# EAGLE design SequentialVoltageGenerator (EAGLE 9.6.0)

## Sheet 1 of 2
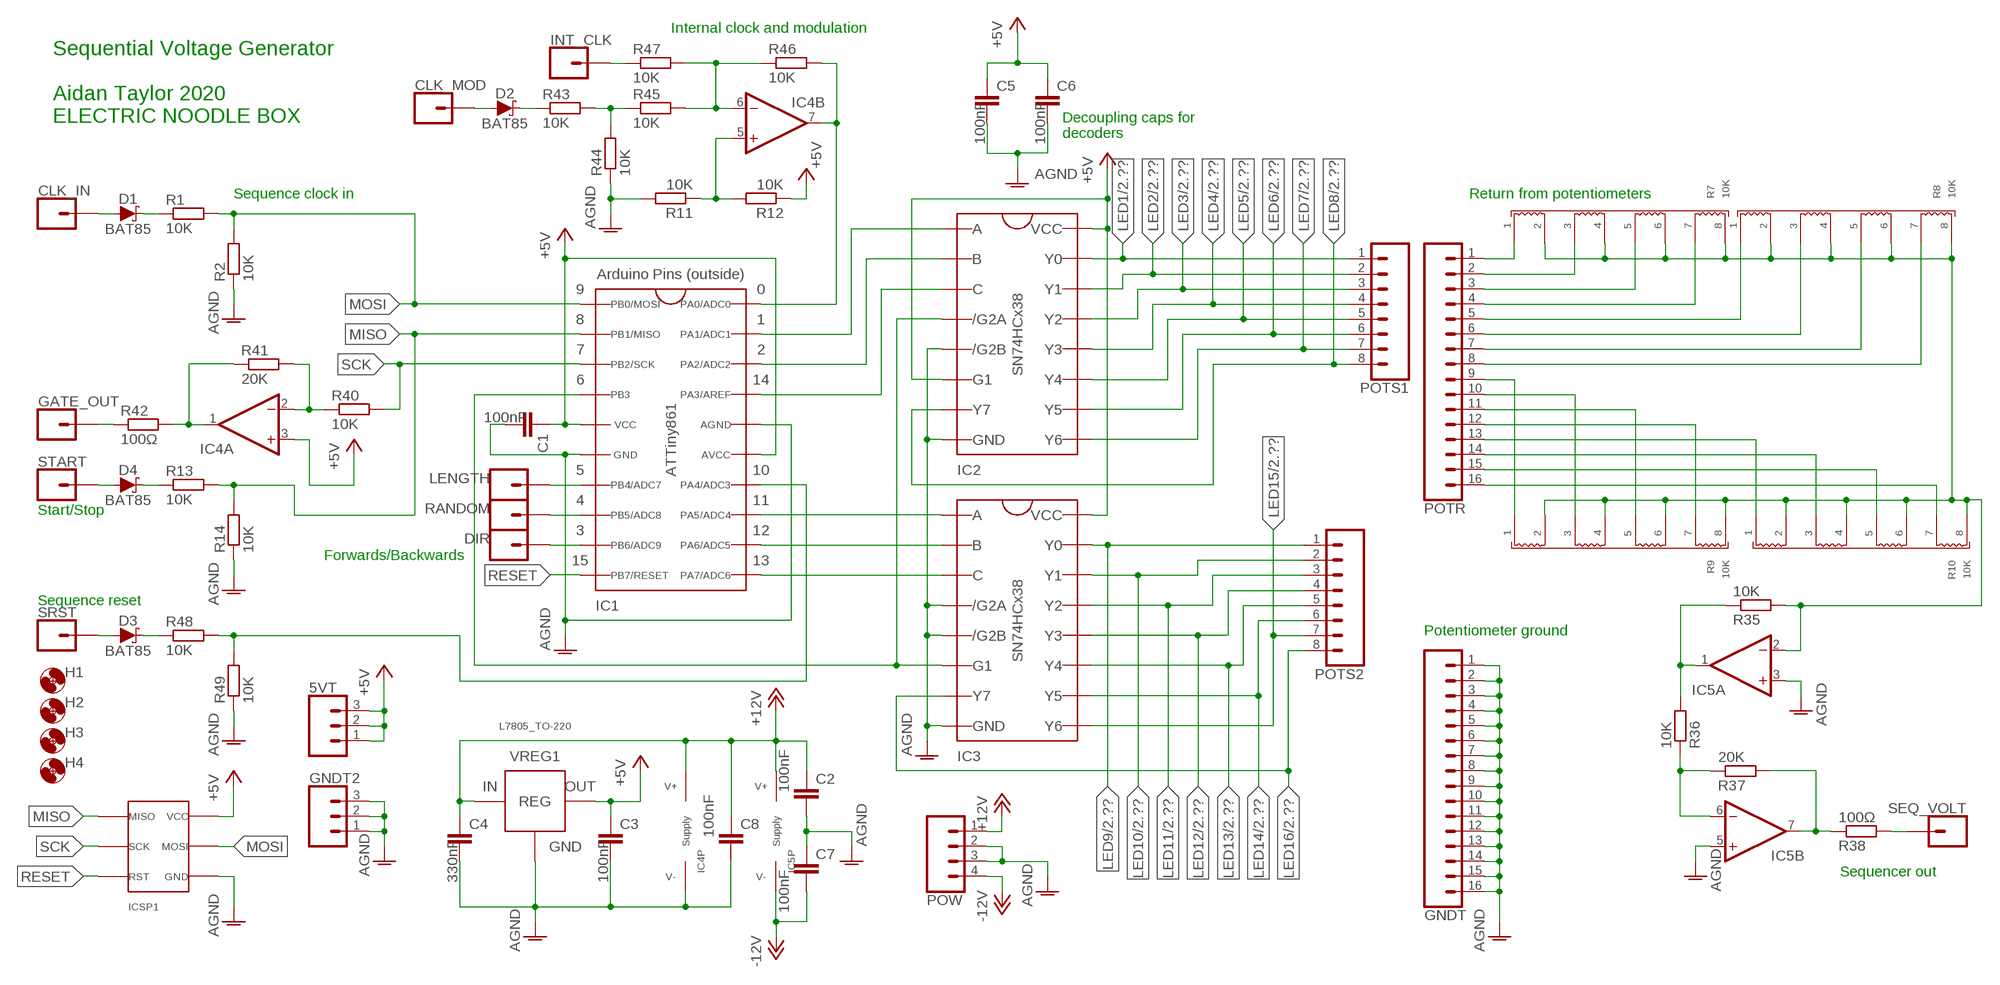
[diagram p0: schematic, sheet 1]

### Parts
5VT  3XWIREPAD  [1X03]
C1  100nF  C-EU050-025X075  [C050-025X075]
C2  100nF  C-EU050-025X075  [C050-025X075]
C3  100nF  C-EU050-025X075  [C050-025X075]
C4  330nF  C-EU050-025X075  [C050-025X075]
C5  100nF  C-EU050-025X075  [C050-025X075]
C6  100nF  C-EU050-025X075  [C050-025X075]
C7  100nF  C-EU050-025X075  [C050-025X075]
C8  100nF  C-EU050-025X075  [C050-025X075]
CLK_IN  1XWIREPAD  [1X01]
CLK_MOD  1XWIREPAD  [1X01]
D1  BAT85  SCHOTTKY_DO35  [DO35-7]
D2  BAT85  SCHOTTKY_DO35  [DO35-7]
D3  BAT85  SCHOTTKY_DO35  [DO35-7]
D4  BAT85  SCHOTTKY_DO35  [DO35-7]
DIR  1XWIREPAD  [1X01]
GATE_OUT  1XWIREPAD  [1X01]
GNDT  16XWIREPAD  [1X16]
GNDT2  3XWIREPAD  [1X03]
H1  MOUNT-HOLE3.2  [3,2]
H2  MOUNT-HOLE3.2  [3,2]
H3  MOUNT-HOLE3.2  [3,2]
H4  MOUNT-HOLE3.2  [3,2]
IC1  ATTINY861_DIP  [DIL20]
IC2  SN74HCX38  [DIL16]
IC3  SN74HCX38  [DIL16]
IC4  LM358_DIP  [DIL08]
IC5  TL0X2_DIP  [DIL08]
ICSP1  ICSP_2.54  [2X3]
INT_CLK  1XWIREPAD  [1X01]
LENGTH  1XWIREPAD  [1X01]
POTR  16XWIREPAD  [1X16]
POTS1  8XWIREPAD  [1X08]
POTS2  8XWIREPAD  [1X08]
POW  4XMOLEX  [MOLEX-1X4]
R1  10K  R-EU_0207/10  [0207/10]
R2  10K  R-EU_0207/10  [0207/10]
R7  10K  4XISO_RESISTOR_NETWORK_2.54  [4_ISO_RES_NET_2.54]
R8  10K  4XISO_RESISTOR_NETWORK_2.54  [4_ISO_RES_NET_2.54]
R9  10K  4XISO_RESISTOR_NETWORK_2.54  [4_ISO_RES_NET_2.54]
R10  10K  4XISO_RESISTOR_NETWORK_2.54  [4_ISO_RES_NET_2.54]
R11  10K  R-EU_0207/10  [0207/10]
R12  10K  R-EU_0207/10  [0207/10]
R13  10K  R-EU_0207/10  [0207/10]
R14  10K  R-EU_0207/10  [0207/10]
R35  10K  R-EU_0207/10  [0207/10]
R36  10K  R-EU_0207/10  [0207/10]
R37  20K  R-EU_0207/10  [0207/10]
R38  100Ω  R-EU_0207/10  [0207/10]
R40  10K  R-EU_0207/10  [0207/10]
R41  20K  R-EU_0207/10  [0207/10]
R42  100Ω  R-EU_0207/10  [0207/10]
R43  10K  R-EU_0207/10  [0207/10]
R44  10K  R-EU_0207/10  [0207/10]
R45  10K  R-EU_0207/10  [0207/10]
R46  10K  R-EU_0207/10  [0207/10]
R47  10K  R-EU_0207/10  [0207/10]
R48  10K  R-EU_0207/10  [0207/10]
R49  10K  R-EU_0207/10  [0207/10]
RANDOM  1XWIREPAD  [1X01]
SEQ_VOLT  1XWIREPAD  [1X01]
SRST  1XWIREPAD  [1X01]
START  1XWIREPAD  [1X01]
VREG1  L7805_TO-220  [TO220H]

### Nets
+5V: 5VT.1 5VT.2 5VT.3 C1.1 C3.1 C5.1 C6.1 IC1.5(VCC) IC1.15(AVCC) IC2.6(6_G1) IC2.16(16_VCC) IC3.16(16_VCC) IC4.3(A:+IN) ICSP1.2(6VCC) R12.1 VREG1.3(VOUT) ; also sheet 2
+12V: C2.1 C4.1 C8.1 IC4.8(P:V+) IC5.8(P:V+) POW.1 VREG1.1(VIN)
-12V: C7.2 IC5.4(P:V-) POW.4
AGND: C1.2 C2.2 C3.2 C4.2 C5.2 C6.2 C7.1 C8.2 GNDT2.1 GNDT2.2 GNDT2.3 GNDT.1 GNDT.2 GNDT.3 GNDT.4 GNDT.5 GNDT.6 GNDT.7 GNDT.8 GNDT.9 GNDT.10 GNDT.11 GNDT.12 GNDT.13 GNDT.14 GNDT.15 GNDT.16 IC1.6(GND) IC1.16(AGND) IC2.5(5_/G2B) IC2.8(8_GND) IC3.4(4_/G2A) IC3.5(5_/G2B) IC3.8(8_GND) IC4.4(P:V-) IC5.3(A:+IN) IC5.5(B:+IN) ICSP1.6(4GND) POW.2 POW.3 R2.1 R11.2 R14.1 R44.1 R49.1 VREG1.2(GND) ; also sheet 2
LED1: IC2.15(15_Y0) POTS1.1 ; also sheet 2
LED2: IC2.14(14_Y1) POTS1.2 ; also sheet 2
LED3: IC2.13(13_Y2) POTS1.3 ; also sheet 2
LED4: IC2.12(12_Y3) POTS1.4 ; also sheet 2
LED5: IC2.11(11_Y4) POTS1.5 ; also sheet 2
LED6: IC2.10(10_Y5) POTS1.6 ; also sheet 2
LED7: IC2.9(9_Y6) POTS1.7 ; also sheet 2
LED8: IC2.7(7_Y7) POTS1.8 ; also sheet 2
LED9: IC3.15(15_Y0) POTS2.1 ; also sheet 2
LED10: IC3.14(14_Y1) POTS2.2 ; also sheet 2
LED11: IC3.13(13_Y2) POTS2.3 ; also sheet 2
LED12: IC3.12(12_Y3) POTS2.4 ; also sheet 2
LED13: IC3.11(11_Y4) POTS2.5 ; also sheet 2
LED14: IC3.10(10_Y5) POTS2.6 ; also sheet 2
LED15: IC3.9(9_Y6) POTS2.7 ; also sheet 2
LED16: IC3.7(7_Y7) POTS2.8 ; also sheet 2
MISO: IC1.2(2_PB1) ICSP1.1(1MISO) R13.2 R14.2
MOSI: IC1.1(1_PB0) ICSP1.4(5MOSI) R1.2 R2.2
N$1: IC1.4(4_PB3) IC2.4(4_/G2A) IC3.6(6_G1)
N$2: IC1.17(17_PA3) IC2.3(3_C)
N$3: IC1.18(18_PA2) IC2.2(2_B)
N$4: IC1.19(19_PA1) IC2.1(1_A)
N$5: D4.A START.1
N$6: IC1.12(12_PA6) IC3.2(2_B)
N$7: IC1.11(11_PA7) IC3.3(3_C)
N$8: CLK_IN.1 D1.A
N$9: D1.C R1.1
N$42: POTR.1 R7.P$1
N$43: POTR.2 R7.P$3
N$44: POTR.3 R7.P$5
N$45: POTR.4 R7.P$7
N$46: POTR.5 R8.P$1
N$47: POTR.6 R8.P$3
N$48: POTR.7 R8.P$5
N$49: POTR.8 R8.P$7
N$50: POTR.9 R9.P$1
N$51: POTR.10 R9.P$3
N$52: POTR.11 R9.P$5
N$53: POTR.12 R9.P$7
N$54: POTR.13 R10.P$1
N$55: POTR.14 R10.P$3
N$56: POTR.15 R10.P$5
N$57: POTR.16 R10.P$7
N$58: IC5.2(A:-IN) R7.P$2 R7.P$4 R7.P$6 R7.P$8 R8.P$2 R8.P$4 R8.P$6 R8.P$8 R9.P$2 R9.P$4 R9.P$6 R9.P$8 R10.P$2 R10.P$4 R10.P$6 R10.P$8 R35.2
N$59: IC5.1(A:OUT) R35.1 R36.2
N$60: IC5.6(B:-IN) R36.1 R37.1
N$61: R38.2 SEQ_VOLT.1
N$62: IC5.7(B:OUT) R37.2 R38.1
N$63: IC4.2(A:-IN) R40.1 R41.2
N$64: GATE_OUT.1 R42.1
N$65: IC4.1(A:OUT) R41.1 R42.2
N$66: D2.C R43.1
N$67: R43.2 R44.2 R45.1
N$68: IC4.6(B:-IN) R45.2 R46.1 R47.2
N$69: IC1.20(20_PA0) IC4.7(B:OUT) R46.2
N$70: INT_CLK.1 R47.1
N$71: CLK_MOD.1 D2.A
N$72: IC1.7(7_PB4) LENGTH.1
N$73: IC1.8(8_PB5) RANDOM.1
N$74: DIR.1 IC1.9(9_PB6)
N$75: D3.A SRST.1
N$76: D3.C R48.1
N$77: IC1.14(14_PA4) R48.2 R49.2
N$78: IC4.5(B:+IN) R11.1 R12.2
N$79: IC1.13(13_PA5) IC3.1(1_A)
N$80: D4.C R13.1
RESET: IC1.10(10_PB7) ICSP1.5(3RST)
SCK: IC1.3(3_PB2) ICSP1.3(2SCK) R40.2

### Notes on the sheet
- Internal clock and modulation
- Sequential Voltage Generator
  
  Aidan Taylor 2020
  ELECTRIC NOODLE BOX
- Decoupling caps for
  decoders
- Sequence clock in | Return from potentiometers
- Start/Stop
- Forwards/Backwards
- Sequence reset
- Potentiometer ground
- Sequencer out

## Sheet 2 of 2
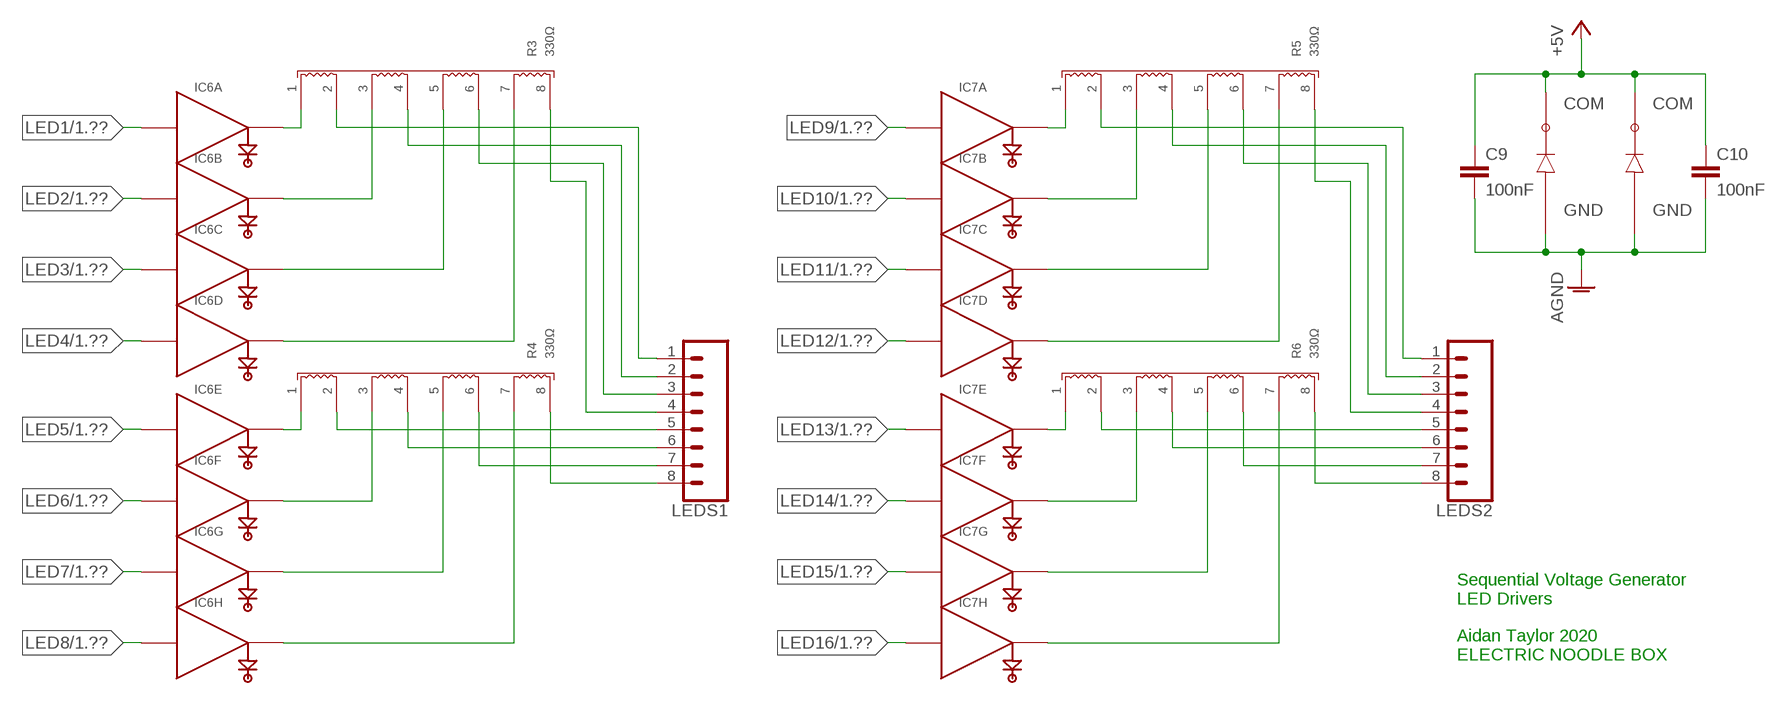
[diagram p1: schematic, sheet 2]

### Parts
C9  100nF  C-EU050-025X075  [C050-025X075]
C10  100nF  C-EU050-025X075  [C050-025X075]
IC6  ULN2801_DIP  [DIL18]
IC7  ULN2801_DIP  [DIL18]
LEDS1  8XWIREPAD  [1X08]
LEDS2  8XWIREPAD  [1X08]
R3  330Ω  4XISO_RESISTOR_NETWORK_2.54  [4_ISO_RES_NET_2.54]
R4  330Ω  4XISO_RESISTOR_NETWORK_2.54  [4_ISO_RES_NET_2.54]
R5  330Ω  4XISO_RESISTOR_NETWORK_2.54  [4_ISO_RES_NET_2.54]
R6  330Ω  4XISO_RESISTOR_NETWORK_2.54  [4_ISO_RES_NET_2.54]

### Nets
+5V: C9.1 C10.1 IC6.10(COM) IC7.10(COM) ; also sheet 1
AGND: C9.2 C10.2 IC6.9(GND) IC7.9(GND) ; also sheet 1
LED1: IC6.1(A:IN) ; also sheet 1
LED2: IC6.2(B:IN) ; also sheet 1
LED3: IC6.3(C:IN) ; also sheet 1
LED4: IC6.4(D:IN) ; also sheet 1
LED5: IC6.5(E:IN) ; also sheet 1
LED6: IC6.6(F:IN) ; also sheet 1
LED7: IC6.7(G:IN) ; also sheet 1
LED8: IC6.8(H:IN) ; also sheet 1
LED9: IC7.1(A:IN) ; also sheet 1
LED10: IC7.2(B:IN) ; also sheet 1
LED11: IC7.3(C:IN) ; also sheet 1
LED12: IC7.4(D:IN) ; also sheet 1
LED13: IC7.5(E:IN) ; also sheet 1
LED14: IC7.6(F:IN) ; also sheet 1
LED15: IC7.7(G:IN) ; also sheet 1
LED16: IC7.8(H:IN) ; also sheet 1
N$10: IC6.18 R3.P$1
N$11: LEDS1.1 R3.P$2
N$12: IC6.17 R3.P$3
N$13: LEDS1.2 R3.P$4
N$14: IC6.16 R3.P$5
N$15: LEDS1.3 R3.P$6
N$16: IC6.15 R3.P$7
N$17: LEDS1.4 R3.P$8
N$18: IC6.14 R4.P$1
N$19: LEDS1.5 R4.P$2
N$20: IC6.13 R4.P$3
N$21: LEDS1.6 R4.P$4
N$22: IC6.12 R4.P$5
N$23: LEDS1.7 R4.P$6
N$24: IC6.11 R4.P$7
N$25: LEDS1.8 R4.P$8
N$26: IC7.18 R5.P$1
N$27: LEDS2.1 R5.P$2
N$28: IC7.17 R5.P$3
N$29: LEDS2.2 R5.P$4
N$30: IC7.16 R5.P$5
N$31: LEDS2.3 R5.P$6
N$32: IC7.15 R5.P$7
N$33: LEDS2.4 R5.P$8
N$34: IC7.14 R6.P$1
N$35: LEDS2.5 R6.P$2
N$36: IC7.13 R6.P$3
N$37: LEDS2.6 R6.P$4
N$38: IC7.12 R6.P$5
N$39: LEDS2.7 R6.P$6
N$40: IC7.11 R6.P$7
N$41: LEDS2.8 R6.P$8

### Notes on the sheet
- Sequential Voltage Generator
  LED Drivers
  
  Aidan Taylor 2020
  ELECTRIC NOODLE BOX

## Library data of the parts
5VT GNDT2 = ElectricNoodleBox:3XWIREPAD
C1-C10 = rcl:C-EU: CAPACITOR, European symbol; SPICEPREFIX: C
CLK_IN CLK_MOD DIR GATE_OUT INT_CLK LENGTH RANDOM SEQ_VOLT SRST START = ElectricNoodleBox:1XWIREPAD
D1-D4 = ElectricNoodleBox:SCHOTTKY_DO35
GNDT POTR = ElectricNoodleBox:16XWIREPAD
H1-H4 = holes:MOUNT-HOLE: MOUNTING HOLE with drill center marker
IC1 = ElectricNoodleBox:ATTINY861_DIP
IC2 IC3 = ElectricNoodleBox:SN74HCX38
IC4 = ElectricNoodleBox:LM358_DIP
IC5 = ElectricNoodleBox:TL0X2_DIP
IC6 IC7 = ElectricNoodleBox:ULN2801_DIP
ICSP1 = ElectricNoodleBox:ICSP_2.54
LEDS1 LEDS2 POTS1 POTS2 = ElectricNoodleBox:8XWIREPAD
POW = ElectricNoodleBox:4XMOLEX
R1 R2 R11-R14 R35-R38 R40-R49 = rcl:R-EU_: RESISTOR, European symbol; SPICEPREFIX: R
R3-R10 = ElectricNoodleBox:4XISO_RESISTOR_NETWORK_2.54
VREG1 = ElectricNoodleBox:L7805_TO-220

## Board
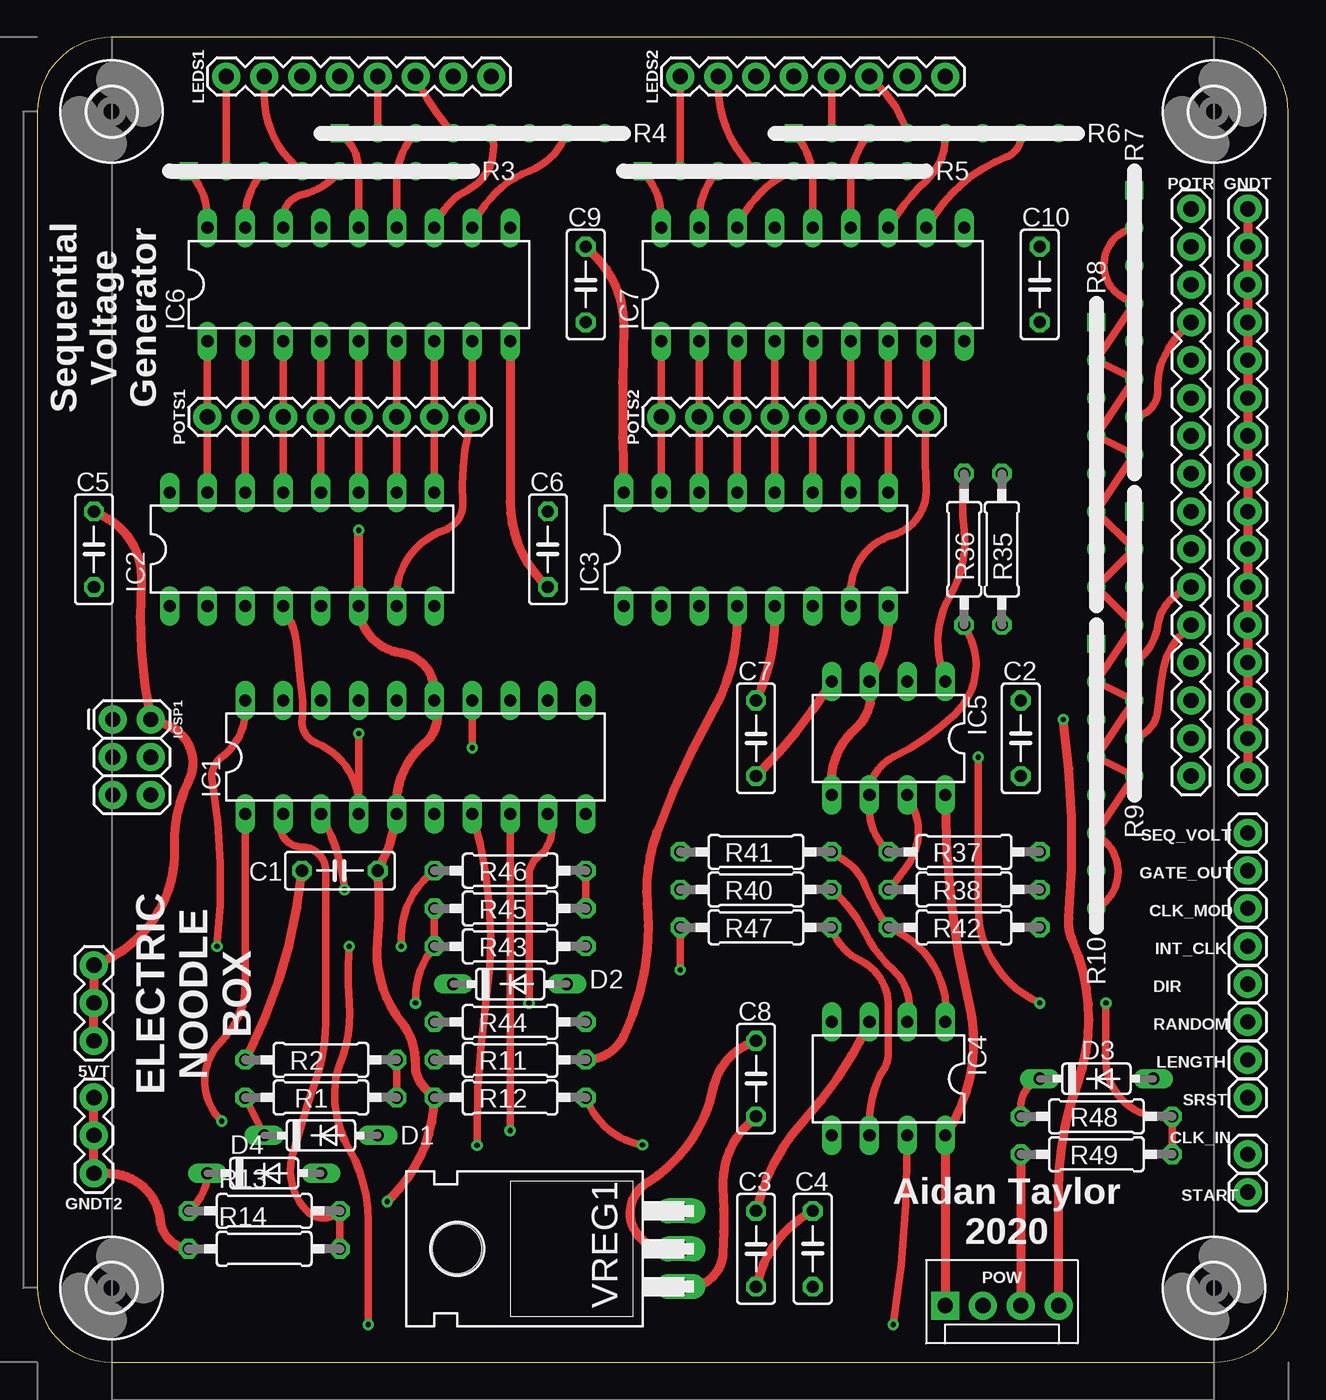
[diagram p2: board, top side]
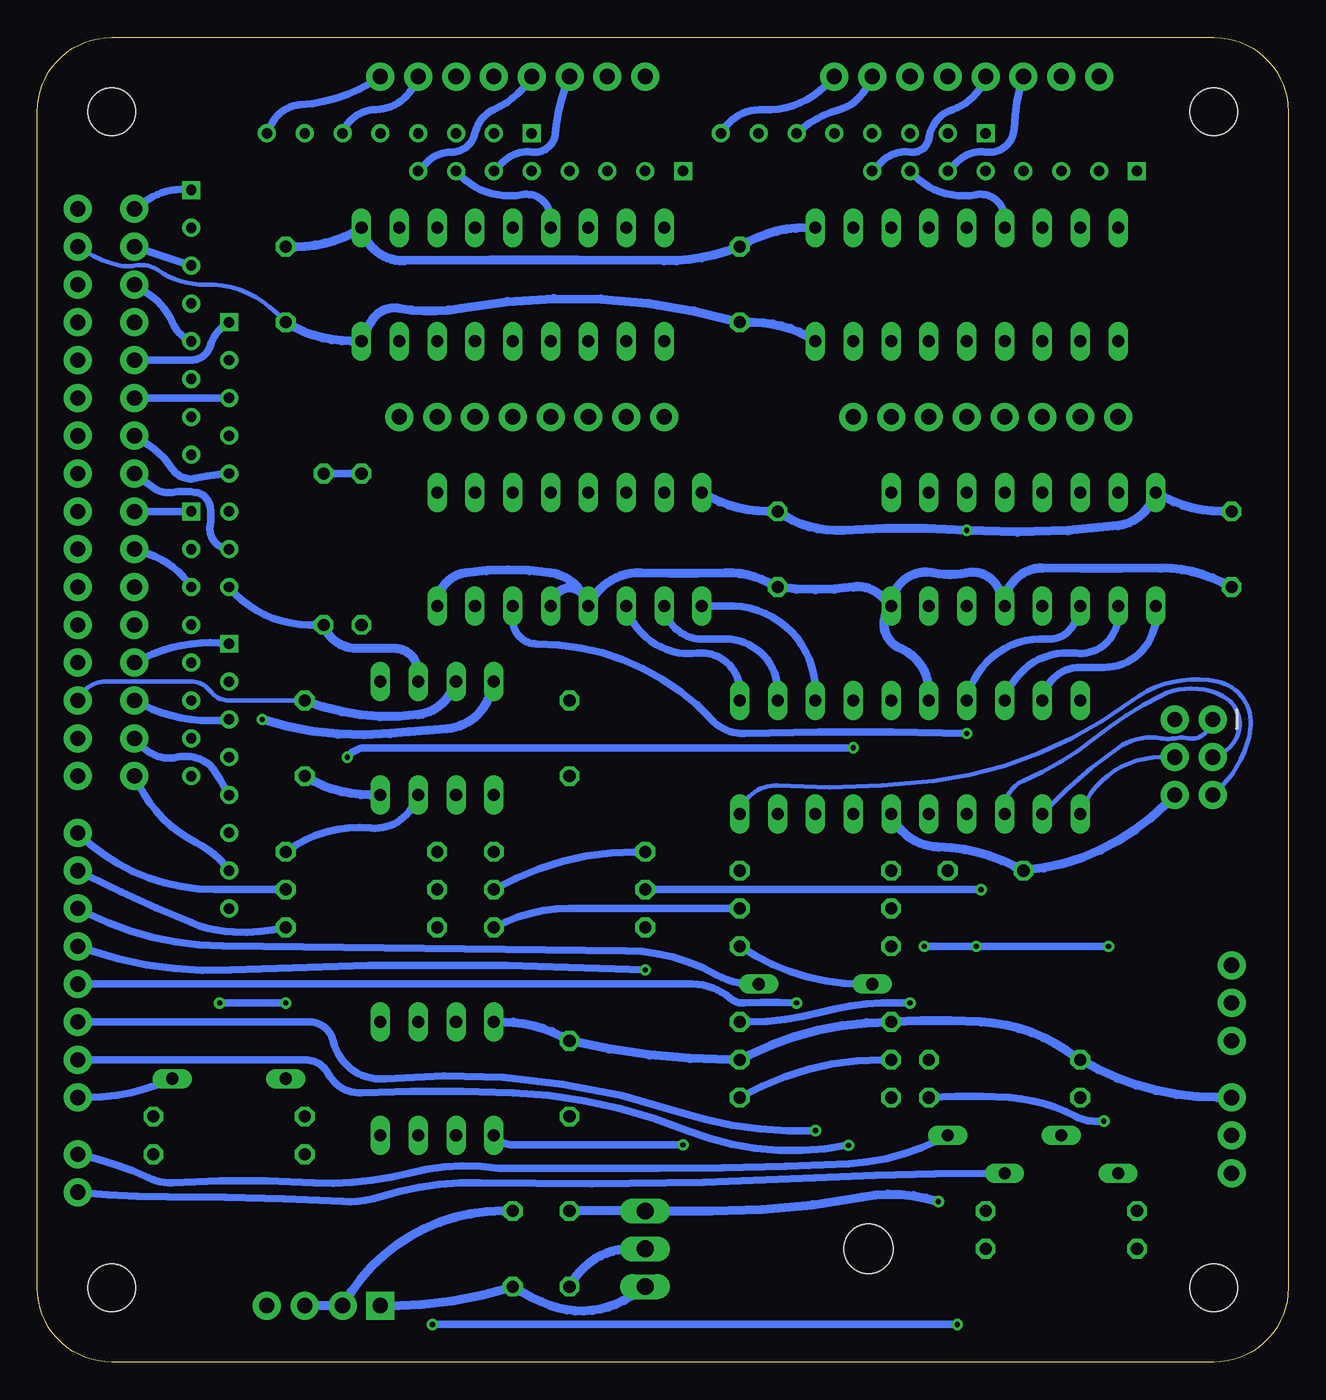
[diagram p3: board, bottom side, seen from below]

Size 84 x 89 mm. Coordinates in mm from the lower left corner, seen from the top.
Outline: 0,84 0,5 arc90 5,0 79,0 arc90 84,5 84,84 arc90 79,89 5,89 arc90 0,84
Copper layers (1*16): Top 0.035mm / dielectric 1.5mm / Bottom 0.035mm
Design rules "default": minimum track width 6mil, minimum drill 0.35mm, track to track 6mil, track to pad 6mil, pad to pad 6mil, via to via 6mil, smd to smd 6mil, copper to edge 40mil, drill to drill 6mil, minimum pad ring 10mil, minimum via ring 8mil, stop-mask expansion 4mil, vias tented up to drill 0mil, thermal gap 10mil

### Footprints (pad centres in the part's own frame; a part is rotated, then mirrored left to right if it is on the bottom)
1X03 = drill 1.016 pad 1.88: 1 0,0; 2 2.54,0; 3 5.08,0
C050-025X075 = drill 0.813 octagon: 1 -2.54,0; 2 2.54,0
1X01 = drill 1.016 pad 1.88: 1 0,0
DO35-7 = drill 0.813 long: A 3.81,0; C -3.81,0
1X16 = drill 1.016 pad 1.88: 1 0,0; 2 2.54,0; 3 5.08,0; 4 7.62,0; 5 10.16,0; 6 12.7,0; 7 15.24,0; 8 17.78,0; 9 20.32,0; 10 22.86,0; 11 25.4,0; 12 27.94,0; 13 30.48,0; 14 33.02,0; 15 35.56,0; 16 38.1,0
3,2 = hole 3.2: 0,0
DIL20 = drill 0.813 long: 1 -11.43,-3.81; 2 -8.89,-3.81; 3 -6.35,-3.81; 4 -3.81,-3.81; 5 -1.27,-3.81; 6 1.27,-3.81; 7 3.81,-3.81; 8 6.35,-3.81; 9 8.89,-3.81; 10 11.43,-3.81; 11 11.43,3.81; 12 8.89,3.81; 13 6.35,3.81; 14 3.81,3.81; 15 1.27,3.81; 16 -1.27,3.81; 17 -3.81,3.81; 18 -6.35,3.81; 19 -8.89,3.81; 20 -11.43,3.81
DIL16 = drill 0.813 long: 1 -8.89,-3.81; 2 -6.35,-3.81; 3 -3.81,-3.81; 4 -1.27,-3.81; 5 1.27,-3.81; 6 3.81,-3.81; 7 6.35,-3.81; 8 8.89,-3.81; 9 8.89,3.81; 10 6.35,3.81; 11 3.81,3.81; 12 1.27,3.81; 13 -1.27,3.81; 14 -3.81,3.81; 15 -6.35,3.81; 16 -8.89,3.81
DIL08 = drill 0.813 long: 1 -3.81,-3.81; 2 -1.27,-3.81; 3 1.27,-3.81; 4 3.81,-3.81; 5 3.81,3.81; 6 1.27,3.81; 7 -1.27,3.81; 8 -3.81,3.81
DIL18 = drill 0.813 long: 1 -10.16,-3.81; 2 -7.62,-3.81; 3 -5.08,-3.81; 4 -2.54,-3.81; 5 0,-3.81; 6 2.54,-3.81; 7 5.08,-3.81; 8 7.62,-3.81; 9 10.16,-3.81; 10 10.16,3.81; 11 7.62,3.81; 12 5.08,3.81; 13 2.54,3.81; 14 0,3.81; 15 -2.54,3.81; 16 -5.08,3.81; 17 -7.62,3.81; 18 -10.16,3.81
2X3 = drill 1.016 pad 1.88: 1 0,0; 2 0,2.54; 3 2.54,0; 4 2.54,2.54; 5 5.08,0; 6 5.08,2.54
1X08 = drill 1.016 pad 1.88: 1 0,0; 2 2.54,0; 3 5.08,0; 4 7.62,0; 5 10.16,0; 6 12.7,0; 7 15.24,0; 8 17.78,0
MOLEX-1X4 = drill 1.016 pad 1.88 square: 1 0,0 | drill 1.016 pad 1.88: 2 2.54,0; 3 5.08,0; 4 7.62,0
0207/10 = drill 0.813 octagon: 1 -5.08,0; 2 5.08,0
4_ISO_RES_NET_2.54 = drill 0.7 square: P$1 -8.89,0 | drill 0.7: P$2 -6.35,0; P$3 -3.81,0; P$4 -1.27,0; P$5 1.27,0; P$6 3.81,0; P$7 6.35,0; P$8 8.89,0
TO220H = drill 1.118 long: 1 -2.54,-10.16; 2 0,-10.16; 3 2.54,-10.16 | hole 3.302: 0,4.826

### Placement (x,y rotation side)
5VT  3.81,21.59 90 top
C1  20.32,33.02 180 top
C2  66.04,41.91 90 top
C3  48.26,7.62 270 top
C4  52.07,7.62 90 top
C5  3.81,54.61 270 top
C6  34.29,54.61 270 top
C7  48.26,41.91 270 top
C8  48.26,19.05 90 top
C9  36.83,72.39 270 top
C10  67.31,72.39 270 top
CLK_IN  81.28,13.97 0 top
CLK_MOD  81.28,30.48 0 top
D1  19.05,15.24 0 top
D2  31.75,25.4 0 top
D3  71.12,19.05 0 top
D4  15.24,12.7 0 top
DIR  81.28,25.4 0 top
GATE_OUT  81.28,33.02 0 top
GNDT  81.28,77.47 270 top
GNDT2  3.81,12.7 90 top
H1  79,5 0 top
H2  5,5 0 top
H3  79,84 0 top
H4  5,84 0 top
IC1  25.4,40.64 0 top
IC2  17.78,54.61 0 top
IC3  48.26,54.61 0 top
IC4  57.15,19.05 180 top
IC5  57.15,41.91 180 top
IC6  21.59,72.39 0 top
IC7  52.07,72.39 0 top
ICSP1  5.08,43.18 270 top
INT_CLK  81.28,27.94 0 top
LEDS1  12.7,86.36 0 top
LEDS2  43.18,86.36 0 top
LENGTH  81.28,20.32 0 top
POTR  77.47,77.47 270 top
POTS1  11.43,63.5 0 top
POTS2  41.91,63.5 0 top
POW  60.96,3.81 0 top
R1  19.05,17.78 0 top
R2  19.05,20.32 0 top
R3  19.05,80.01 0 top
R4  29.21,82.55 0 top
R5  49.53,80.01 0 top
R6  59.69,82.55 0 top
R7  73.66,69.85 270 top
R8  71.12,60.96 270 top
R9  73.66,48.26 270 top
R10  71.12,39.37 270 top
R11  31.75,20.32 0 top
R12  31.75,17.78 0 top
R13  15.24,10.16 0 top
R14  15.24,7.62 0 top
R35  64.77,54.61 270 top
R36  62.23,54.61 90 top
R37  62.23,34.29 0 top
R38  62.23,31.75 0 top
R40  48.26,31.75 180 top
R41  48.26,34.29 180 top
R42  62.23,29.21 180 top
R43  31.75,27.94 180 top
R44  31.75,22.86 0 top
R45  31.75,30.48 0 top
R46  31.75,33.02 180 top
R47  48.26,29.21 0 top
R48  71.12,16.51 0 top
R49  71.12,13.97 0 top
RANDOM  81.28,22.86 0 top
SEQ_VOLT  81.28,35.56 0 top
SRST  81.28,17.78 0 top
START  81.28,11.43 0 top
VREG1  33.02,7.62 90 top

### Tracks (layer width: path | path; a pad name or v marks a point on that pad's centre or on a via)
+5V  (via drill 0.35)
  Top 0.61: C9.1 37.47,74.3 arc-46 39.37,69.53 arc3 IC3.16 | C5.1 4.45,56.83 arc-67 6.99,52.39 arc16 ICSP1.2 8.57,42.86 arc-98 10.16,39.05 arc28 9.21,34.61 arc-73 5VT.3 5VT.2 5VT.1 | v21.59,55.88 IC2.6 arc81 24.45,47.62 arc-82 26.67,45.09 IC1.15 arc-74 26.04,41.59 arc50 24.13,37.47 IC1.5 arc-20 23.18,33.66 C1.1 arc-11 22.86,28.26 arc44 24.45,22.86 arc-40 25.4,20 arc46 26.04,18.41 R12.1 arc-44 23.81,11.11 v23.5,10.79 | IC4.3 55.56,22.23 arc-16 51.44,16.19 arc29 C3.1
  Bottom 0.61: C5.1 4.45,57.15 arc32 IC2.16 9.21,57.78 arc56 11.43,56.2 arc12 v21.59,55.88 arc-8 29.84,55.88 arc40 C6.1 34.92,57.15 arc32 IC3.16 | IC6.10 32.38,76.2 arc-32 C9.1 37.78,74.61 arc19 41.91,73.98 arc-2 59.37,73.98 arc78 IC7.10 arc32 66.67,74.93 C10.1 | C3.1 VREG1.3 38.73,10.16 arc-11 28.57,11.11 arc29 v23.5,10.79
+12V
  Top 0.61: IC5.8 60.96,37.47 arc14 62.55,24.13 arc-47 IC4.8 POW.1 | C8.1 47.62,15.88 arc48 46.04,11.75 arc-6 46.04,7.3 arc-98 VREG1.1
  Bottom 0.61: IC5.8 61.59,38.1 arc32 C2.1 | VREG1.1 44.13,4.45 arc54 49.53,3.81 arc13 C4.1 arc17 60.33,3.81 POW.1
-12V  (via drill 0.35)
  Top 0.61: C7.2 48.58,39.69 arc10 52.07,43.81 arc4 IC5.4 | POW.4 68.58,11.43 arc-20 69.85,18.73 arc43 69.53,28.26 arc-28 69.27,29.84 arc12 v68.9,43.18
  Bottom 0.61: IC5.4 53.66,44.77 arc67 56.52,42.55 arc-1 60.33,42.23 arc23 v68.9,43.18
AGND
  Top 0.61: C6.2 arc-48 31.75,57.78 IC6.9 | GNDT.1 GNDT.2 GNDT.3 GNDT.4 GNDT.5 GNDT.6 GNDT.7 GNDT.8 GNDT.9 GNDT.10 GNDT.11 GNDT.12 GNDT.13 GNDT.14 GNDT.15 GNDT.16 | IC3.5 49.53,50.16 arc-25 C7.1 | IC3.8 57.15,50.16 arc-32 IC5.3 arc-64 54.93,42.55 arc49 53.34,39.05 IC5.5 | C3.2 48.58,6.03 arc-44 C4.2 | R49.1 POW.3 | R2.1 14.29,20.95 arc21 C1.2 | GNDT2.3 GNDT2.2 GNDT2.1 4.76,12.7 arc-85 8.26,9.53 arc79 R14.1 | VREG1.2 42.23,7.62 arc-148 40.96,12.06 arc46 45.4,18.41 arc-60 C8.2 | IC3.4 46.99,49.85 arc-29 45.4,43.81 arc9 41.59,35.56 arc25 40.96,30.8 arc-30 39.37,21.91 arc-66 R11.2
  Bottom 0.305: C2.2 71.12,44.45 arc53 72.39,45.09 arc-53 73.66,45.72 79.38,45.72 arc-67 GNDT.14 | C10.2 67.94,70.48 arc-46 72.71,72.39 arc36 75.88,73.34 arc-47 77.47,73.66 arc24 78.42,73.66 arc24 GNDT.2
  Bottom 0.61: C5.2 4.45,52.39 arc-27 8.57,53.34 arc1 16.51,53.34 arc-91 IC2.5 19.37,51.75 arc-84 21.59,53.02 arc24 23.81,53.02 arc-100 IC2.8 | C10.2 arc-32 62.87,68.58 IC7.9 61.59,69.85 arc74 59.69,70.8 arc-21 55.56,70.8 arc26 C9.2 35.88,69.85 arc34 IC6.9 | IC2.8 27.3,51.44 arc-53 29.21,52.07 arc16 C6.2 34.92,52.39 arc-28 37.78,53.02 arc3 43.5,53.02 arc-68 IC3.4 47.31,51.44 | 47.31,51.44 arc-56 49.53,53.02 arc-15 55.24,53.02 arc-84 IC3.8 | IC3.5 49.21,51.44 arc127 47.31,51.44 | IC1.16 24.13,45.09 arc-67 26.04,47.94 arc110 IC2.8 | IC5.3 56.2,45.09 arc56 58.42,43.5 arc30 C2.2 | IC4.4 52.7,22.86 arc32 C8.2 arc-13 37.47,20.32 R11.2 36.2,20.64 arc27 R44.1 arc6 20.64,22.86 arc31 14.92,20.95 R2.1 arc-31 4.76,17.78 GNDT2.3 | POW.3 POW.2 arc61 52.7,10.16 C4.2 | VREG1.2 44.13,7.62 arc-63 C3.2 | IC1.6 arc-67 23.5,34.61 arc25 18.41,33.34 C1.2 arc-40 8.26,37.47 ICSP1.6
LED1
  Top 0.508: IC2.15 POTS1.1 IC6.1
LED2
  Top 0.508: IC2.14 POTS1.2 IC6.2
LED3
  Top 0.508: IC2.13 POTS1.3 IC6.3
LED4
  Top 0.508: IC2.12 POTS1.4 IC6.4
LED5
  Top 0.508: IC2.11 POTS1.5 IC6.5
LED6
  Top 0.508: IC2.10 POTS1.6 IC6.6
LED7
  Top 0.508: IC2.9 POTS1.7 IC6.7
LED8
  Top 0.508: IC2.7 24.13,51.44 arc-71 27.3,55.88 arc75 28.57,57.78 arc-20 POTS1.8 IC6.8
LED9
  Top 0.508: IC3.15 POTS2.1 IC7.1
LED10
  Top 0.508: IC7.2 POTS2.2 IC3.14
LED11
  Top 0.508: IC3.13 POTS2.3 IC7.3
LED12
  Top 0.508: IC7.4 POTS2.4 IC3.12
LED13
  Top 0.508: IC3.11 POTS2.5 IC7.5
LED14
  Top 0.508: IC7.6 POTS2.6 IC3.10
LED15
  Top 0.508: IC3.9 POTS2.7 IC7.7
LED16
  Top 0.508: IC3.7 54.61,51.75 arc-74 57.47,55.56 arc77 59.69,58.74 arc-8 POTS2.8 IC7.8
MISO
  Top 0.508: IC1.2 arc121 17.78,34.61 arc-90 19.37,33.02 19.37,22.86 arc-19 18.73,19.05 arc3 17.14,13.97 arc60 18.1,10.16 arc92 R13.2 R14.2
  Bottom 0.305: ICSP1.1 5.4,42.55 arc74 6.67,41.91 arc-21 7.62,41.91 arc21 8.57,41.91 arc-46 11.43,41.27 arc-12 IC1.2
MOSI  (via drill 0.35)
  Top 0.508: R2.2 R1.2 | IC1.1 13.97,25.4 arc-45 12.38,21.59 arc90 v12.38,16.19
  Bottom 0.305: ICSP1.4 8.57,40.64 arc-70 IC1.1
  Bottom 0.508: v12.38,16.19 13.02,16.19 arc28 14.29,16.51 arc-24 18.73,17.78 arc-8 R1.2
N$1  (via drill 0.35)
  Top 0.508: IC2.4 16.83,50.16 arc-21 17.46,47.94 arc1 17.78,44.77 arc-12 17.78,43.18 arc74 18.73,41.59 arc-74 IC1.4 v21.59,42.23
  Bottom 0.508: IC3.6 52.07,49.85 arc-90 50.48,48.26 arc42 39.69,44.13 arc6 38.73,43.18 arc-50 36.51,42.23 arc4 v21.59,42.23
N$2
  Bottom 0.508: IC2.3 14.29,49.85 arc76 16.19,48.58 arc-83 IC1.17
N$3
  Bottom 0.508: IC2.2 11.43,50.16 arc97 14.29,47.62 arc-81 IC1.18
N$4
  Bottom 0.508: IC2.1 8.89,50.16 arc90 12.38,46.67 13.97,46.67 arc-82 IC1.19
N$5
  Bottom 0.508: D4.A 19.68,12.7 arc-3 31.75,12.38 arc4 54.29,12.06 arc-19 60.96,11.11 arc21 63.5,10.79 arc-4 75.25,11.11 arc7 START.1
N$6
  Bottom 0.508: IC1.12 34.29,45.09 arc-90 37.78,48.58 39.37,48.58 arc82 IC3.2
N$7
  Bottom 0.508: IC1.11 36.83,45.09 arc-97 39.69,47.62 arc81 IC3.3
N$8
  Bottom 0.508: CLK_IN.1 80.01,13.65 arc12 76.52,12.38 arc-29 74.93,12.06 arc7 65.41,12.06 arc-18 59.05,12.7 arc23 53.02,13.02 42.23,13.02 arc-3 29.53,13.34 arc-24 23.5,14.92 D1.A
N$9
  Top 0.508: R1.1 D1.C
N$10
  Top 0.508: IC6.18 11.43,76.83 arc44 R3.P$1
N$11
  Top 0.508: LEDS1.1 R3.P$2
N$12
  Top 0.508: IC6.17 13.97,76.83 arc-44 R3.P$3
N$13
  Top 0.508: LEDS1.2 15.24,85.09 arc53 R3.P$4
N$14
  Top 0.508: IC6.16 16.51,76.83 arc-77 17.78,78.42 arc39 R3.P$5
N$15
  Bottom 0.508: R3.P$6 22.23,80.64 arc53 20.32,81.28 arc-96 18.41,82.87 arc16 LEDS1.3
N$16
  Bottom 0.508: IC6.15 19.05,76.83 arc-100 20.95,78.42 arc60 R3.P$7
N$17
  Bottom 0.508: R3.P$8 27.3,80.64 arc53 25.4,81.28 arc-90 24.13,82.23 arc63 22.54,84.14 arc-53 LEDS1.4
N$18
  Top 0.508: R4.P$1 arc-53 21.59,80.01 IC6.14
N$19
  Top 0.508: LEDS1.5 R4.P$2
N$20
  Top 0.508: IC6.13 24.13,79.38 arc-44 R4.P$3
N$21
  Top 0.508: LEDS1.6 25.72,85.72 arc17 R4.P$4
N$22
  Top 0.508: IC6.12 26.99,76.83 arc-37 28.89,78.74 arc82 R4.P$5
N$23
  Bottom 0.508: LEDS1.7 28.26,85.72 arc47 30.16,84.14 arc-26 R4.P$6
N$24
  Top 0.508: IC6.11 29.53,76.83 arc-42 33.02,80.01 arc48 R4.P$7
N$25
  Bottom 0.508: LEDS1.8 31.11,85.72 arc48 35.24,84.14 arc-64 R4.P$8
N$26
  Top 0.508: IC7.18 41.91,76.83 arc44 R5.P$1
N$27
  Top 0.508: LEDS2.1 R5.P$2
N$28
  Top 0.508: IC7.17 44.45,76.83 arc-44 R5.P$3
N$29
  Top 0.508: LEDS2.2 45.72,85.72 arc48 R5.P$4
N$30
  Top 0.508: IC7.16 47.31,76.83 arc-42 R5.P$5
N$31
  Bottom 0.508: R5.P$6 52.7,80.64 arc53 50.8,81.28 arc-94 49.21,82.55 arc19 LEDS2.3
N$32
  Bottom 0.508: IC7.15 49.53,76.83 arc-100 51.44,78.42 arc60 R5.P$7
N$33
  Bottom 0.508: R5.P$8 57.78,80.64 arc46 56.2,81.28 arc-80 54.61,82.55 arc55 53.34,84.14 arc-34 LEDS2.4
N$34
  Top 0.508: R6.P$1 arc-44 52.07,79.38 IC7.14
N$35
  Top 0.508: LEDS2.5 R6.P$2
N$36
  Top 0.508: IC7.13 54.61,79.06 arc-40 R6.P$3
N$37
  Top 0.508: LEDS2.6 56.52,85.72 arc-28 R6.P$4
N$38
  Top 0.508: IC7.12 57.78,77.15 arc-14 59.69,79.38 arc51 R6.P$5
N$39
  Bottom 0.508: LEDS2.7 58.74,85.72 arc63 61.28,84.14 arc-70 R6.P$6
N$40
  Top 0.508: IC7.11 60.33,77.15 arc-35 65.09,80.96 arc76 R6.P$7
N$41
  Bottom 0.508: R6.P$8 68.26,83.19 arc59 66.36,84.45 arc-31 LEDS2.8
N$42
  Bottom 0.508: POTR.1 76.52,78.11 arc42 R7.P$1
N$43
  Bottom 0.508: POTR.2 R7.P$3
N$44
  Bottom 0.508: POTR.3 76.52,71.75 arc33 74.93,69.85 arc-43 R7.P$5
N$45
  Top 0.508: POTR.4 76.83,69.22 arc23 75.56,67.31 arc26 75.25,65.41 arc-87 R7.P$7
N$46
  Bottom 0.508: R8.P$1 arc-45 72.39,68.26 arc74 73.66,67.31 POTR.5
N$47
  Bottom 0.508: POTR.6 R8.P$3
N$48
  Bottom 0.508: POTR.7 76.52,61.59 arc23 74.93,60.01 arc-69 73.34,59.37 arc9 R8.P$5
N$49
  Bottom 0.508: POTR.8 76.2,58.74 arc-46 74.93,58.42 arc18 73.34,58.42 arc72 72.39,57.47 arc18 72.39,56.2 arc-95 R8.P$7
N$50
  Bottom 0.508: POTR.9 R9.P$1
N$51
  Bottom 0.508: POTR.10 76.52,54.29 arc39 R9.P$3
N$52
  Top 0.508: POTR.11 76.83,51.75 arc56 75.25,49.53 arc-49 R9.P$5
N$53
  Top 0.508: POTR.12 76.83,48.9 arc37 75.56,46.35 arc2 75.25,43.81 arc-67 R9.P$7
N$54
  Bottom 0.508: POTR.13 76.83,47.31 arc20 73.66,48.26 arc14 R10.P$1
N$55
  Bottom 0.508: POTR.14 76.83,44.13 arc-20 73.66,43.18 arc-14 R10.P$3
N$56
  Bottom 0.508: POTR.15 76.83,41.27 arc-58 74.61,40.64 arc45 72.71,40.32 arc26 72.07,39.69 arc2 R10.P$5
N$57
  Bottom 0.508: POTR.16 77.15,38.73 arc-37 73.34,34.92 arc28 R10.P$7
N$58
  Top 0.508: R7.P$2 arc142 73.03,71.44 R7.P$4 R8.P$2 R7.P$6 R8.P$4 R7.P$8 R8.P$6 R9.P$2 R8.P$8 R9.P$4 R10.P$2 R9.P$6 R10.P$4 R9.P$8 R10.P$6 71.75,34.92 arc-106 R10.P$8
  Bottom 0.508: R35.2 65.72,49.53 arc50 R8.P$8
  Bottom 0.61: IC5.2 58.42,46.35 arc-90 60.01,47.94 62.55,47.94 arc71 R35.2
N$59
  Top 0.508: IC5.1 60.64,46.99 arc-44 61.28,51.44 arc36 62.23,55.88 arc-12 R36.2
  Bottom 0.508: R36.2 R35.1
N$60
  Top 0.508: R36.1 62.55,48.9 arc-73 61.59,43.5 arc-17 57.47,40.64 arc64 IC5.6 55.88,37.15 arc48 R37.1
N$61
  Bottom 0.508: SEQ_VOLT.1 arc-45 72.07,31.75 R38.2
N$62
  Top 0.508: IC5.7 58.74,37.47 arc-62 58.42,33.34 arc-7 R38.1
  Bottom 0.508: IC5.7 58.74,37.47 arc69 61.59,35.88 arc-42 R37.2
N$63
  Top 0.508: R40.1 53.98,31.11 arc-19 55.56,28.89 arc22 57.47,26.35 arc-65 IC4.2
  Bottom 0.508: R41.2 43.81,34.29 arc-30 R40.1
N$64
  Bottom 0.508: GATE_OUT.1 80.64,32.7 arc-4 73.66,29.53 arc-20 70.8,28.89 arc-16 R42.1
N$65
  Top 0.508: R41.1 54.29,33.66 arc-35 55.56,32.07 arc16 R42.2 57.78,28.89 arc-71 IC4.1
N$66
  Bottom 0.508: D2.C 28.57,25.4 arc34 R43.1
N$67  (via drill 0.35)
  Top 0.508: R45.1 R43.2 arc40 25.4,24.45 v25.4,24.13
  Bottom 0.508: R44.2 36.2,22.86 arc-15 31.43,23.5 arc13 27.3,24.13 arc5 v25.4,24.13
N$68
  Top 0.508: R46.1 R45.2 | IC4.6 55.88,16.19 arc-31 56.83,19.68 arc33 57.15,20.95 arc-5 57.15,23.81 arc67 55.24,26.99 arc-48 R47.2
  Bottom 0.508: R45.2 48.26,30.48 arc-28 R47.2
N$69  (via drill 0.35)
  Top 0.508: IC4.7 58.42,14.61 arc-9 v57.47,2.54 | v24.45,27.94 24.45,28.57 arc-53 R46.2 | IC1.20 13.97,43.81 arc-53 12.38,40.64 arc63 11.75,39.05 arc-16 v12.06,27.94 arc196 v12.07,27.94 | v22.23,2.54 22.23,9.53 arc30 20.95,14.29 arc-36 20,18.73 arc-17 20.32,20 arc27 20.95,24.13 arc-10 v20.95,27.94
  Bottom 0.508: v57.47,2.54 v22.23,2.54 | v24.45,27.94 v20.95,27.94 v12.07,27.94
N$70  (via drill 0.35)
  Top 0.508: R47.1 v43.18,26.35
  Bottom 0.508: INT_CLK.1 80.33,27.62 arc-21 71.01,26.35 arc6 v43.18,26.35
N$71
  Bottom 0.508: CLK_MOD.1 80.64,30.16 arc-26 71.56,27.96 44.44,27.64 arc29 38.42,26.04 arc-33 D2.A
N$72  (via drill 0.35)
  Top 0.508: v29.53,14.58 29.53,15.24 arc-8 30.16,24.45 arc25 IC1.7
  Bottom 0.508: LENGTH.1 66.04,20.32 arc62 64.45,19.37 arc-64 62.23,18.1 arc5 52.07,18.1 arc20 40.32,15.56 arc-34 29.53,14.61 arc214 v29.53,14.58
N$73  (via drill 0.35)
  Top 0.508: v31.75,15.56 IC1.8
  Bottom 0.508: v31.75,15.56 arc21 40.96,16.83 arc-23 60.64,19.05 arc83 64.14,21.59 arc-77 65.72,22.86 RANDOM.1
N$74  (via drill 0.35)
  Top 0.508: v33.02,24.13 33.02,32.7 arc-53 33.66,33.97 arc81 IC1.9
  Bottom 0.508: DIR.1 40.01,25.4 arc41 37.47,24.45 arc-45 36.51,24.13 arc8 v33.02,24.13
N$75
  Bottom 0.508: SRST.1 80.64,17.78 arc-25 D3.A
N$76
  Top 0.508: R48.1 66.04,17.14 arc-67 D3.C
N$77  (via drill 0.35)
  Top 0.508: R49.2 R48.2 arc-99 71.75,20.32 v71.75,24.13 | IC1.14 v29.21,41.27 | v63.18,40.64 63.18,30.48 arc66 v67.31,24.13
  Bottom 0.508: v29.21,41.27 61.91,41.27 arc-53 v63.18,40.64 | v67.31,24.13 v71.75,24.13
N$78  (via drill 0.35)
  Top 0.508: R12.2 37.15,17.14 arc55 v40.64,14.61
  Bottom 0.508: R11.1 27.3,20.32 arc-30 R12.2 | v40.64,14.61 52.07,14.61 arc53 IC4.5
N$79
  Bottom 0.508: IC1.13 31.75,45.09 arc-93 37.78,50.8 arc6 IC3.1
N$80
  Top 0.508: R13.1 10.48,10.48 arc44 D4.C
RESET
  Bottom 0.305: ICSP1.5 4.45,38.73 arc-37 2.54,42.55 arc-86 4.76,45.72 arc-49 10.48,44.45 arc30 23.81,39.05 arc11 34.29,38.73 arc-81 IC1.10
SCK  (via drill 0.35)
  Top 0.508: IC1.3 19.37,36.2 arc-21 v20.64,31.75
  Bottom 0.305: ICSP1.3 4.45,40.96 arc-127 4.45,44.77 arc-53 8.57,44.77 arc-12 13.02,41.91 arc16 17.78,39.05 arc-74 IC1.3
  Bottom 0.508: R40.2 v20.64,31.75

### Text on the board
tPlace: Sequential / Voltage / Generator | ELECTRIC / NOODLE / BOX | Aidan Taylor / 2020